# Altium schematic sheet Infrared_Send.SchDoc
size A4
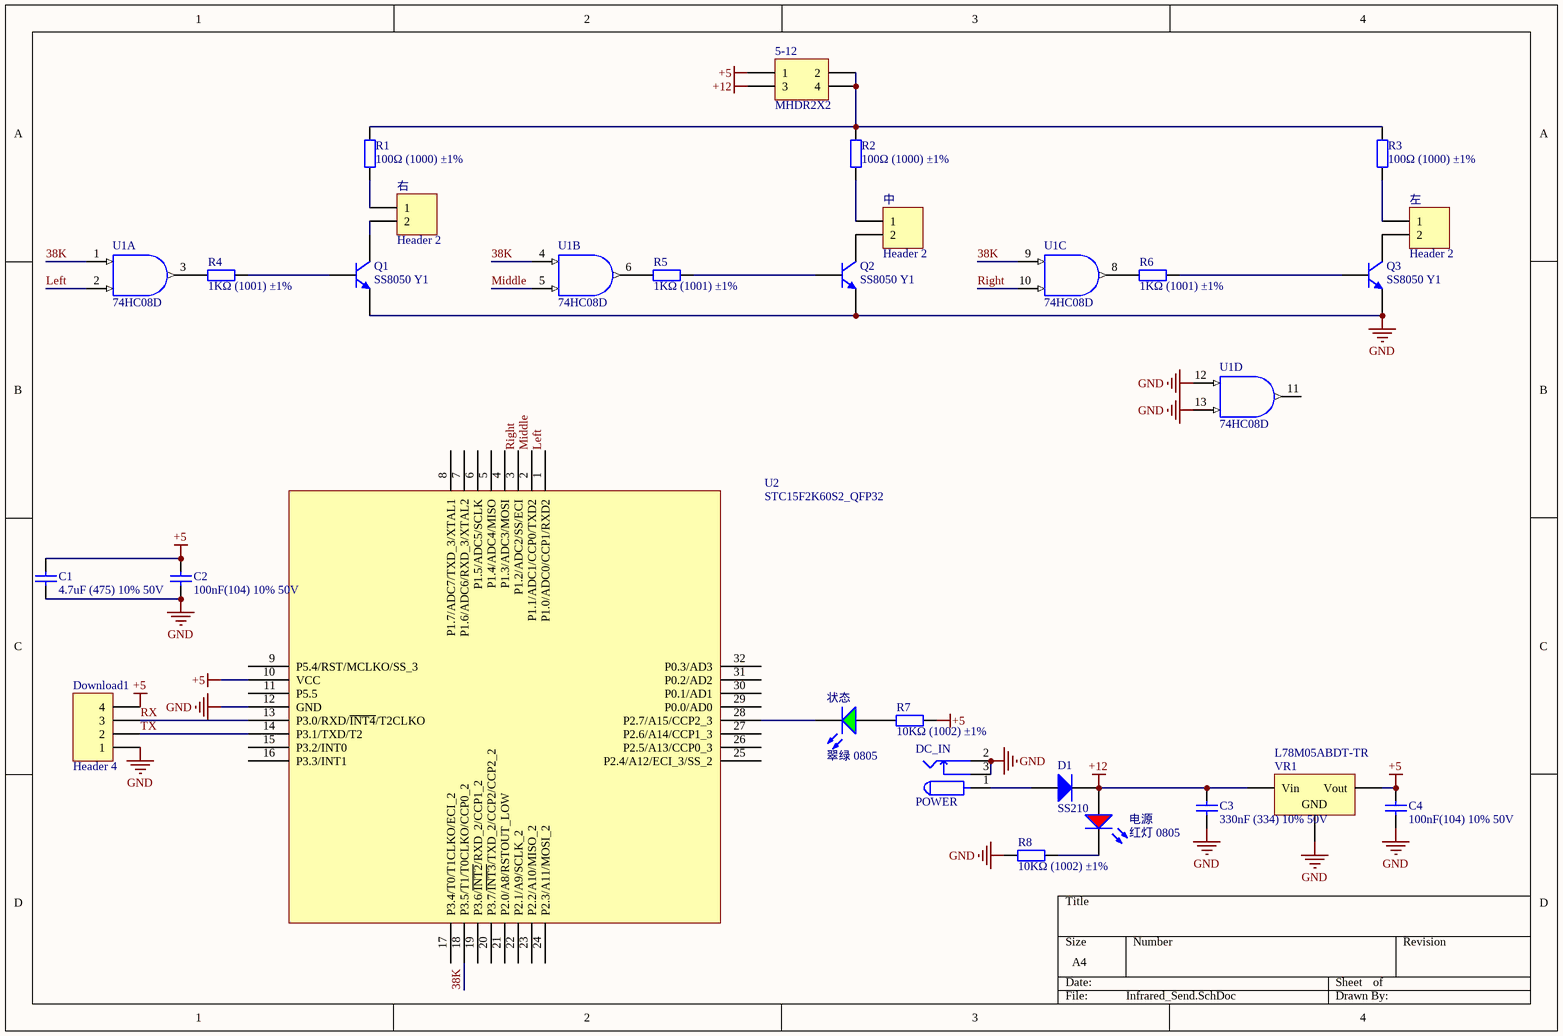
[diagram p0: Infrared_Send.SchDoc]

## Parts
5-12  MHDR2X2  [MHDR2X2]
C1  4.7uF (475) 10% 50V  [LC-1206_C]
C2  100nF(104) 10% 50V  [LC-0805_C]
C3  330nF (334) 10% 50V  [LC-0805_C]
C4  100nF(104) 10% 50V  [LC-0805_C]
D1  SS210  [LC-SMA(DO-214AC)_S1]
DC_IN  POWER  [DC10B]
Download1  Header 4  [HDR1X4]
Q1  SS8050 Y1  [LC-SOT-23(SOT-23-3)]
Q2  SS8050 Y1  [LC-SOT-23(SOT-23-3)]
Q3  SS8050 Y1  [LC-SOT-23(SOT-23-3)]
R1  100Ω (1000) ±1%  [LC-0805_R]
R2  100Ω (1000) ±1%  [LC-0805_R]
R3  100Ω (1000) ±1%  [LC-0805_R]
R4  1KΩ (1001) ±1%  [LC-0805_R]
R5  1KΩ (1001) ±1%  [LC-0805_R]
R6  1KΩ (1001) ±1%  [LC-0805_R]
R7  10KΩ (1002) ±1%  [LC-0805_R]
R8  10KΩ (1002) ±1%  [LC-0805_R]
U1  74HC08D  [LC-SOIC-14_150mil]  (parts A,B,C,D of 4)
U2  STC15F2K60S2_QFP32  [LQFP32]
VR1  L78M05ABDT-TR  [LC-TO-252-2-180]
中  Header 2  [HDR1X2]
右  Header 2  [HDR1X2]
左  Header 2  [HDR1X2]
状态  翠绿 0805  [LC-0805_LED_S1]
电源  红灯 0805  [LC-0805_LED_S1]

## Nets
+5: 5-12.1 C1.2 C2.2 C4.2 Download1.4 R7.1 U2.10(VCC) VR1.3(Vout)
+12: 5-12.3 C3.2 D1.2(K) VR1.1(Vin) 电源.A
GND: C1.1 C2.1 C3.1 C4.1 DC_IN.2 DC_IN.3 Download1.1 Q1.2(E) Q2.2(E) Q3.2(E) R8.1 U1.12(A) U1.13(B) U2.12(GND) VR1.2(GND)
38K: U1.1(A) U1.4(A) U1.9(A) U2.18(P3.5/T1/T0CLKO/CCP0_2)
Left: U1.2(B) U2.1(P1.0/ADC0/CCP1/RXD2)
Middle: U1.5(B) U2.2(P1.1/ADC1/CCP0/TXD2)
Right: U1.10(B) U2.3(P1.2/ADC2/SS/ECI)
RX: Download1.3 U2.13(P3.0/RXD/~{INT4}/T2CLKO)
TX: Download1.2 U2.14(P3.1/TXD/T2)
Net5-12_2: 5-12.2 5-12.4 R1.2 R2.2 R3.2
NetD1_1: D1.1(A) DC_IN.1
NetQ1_1: Q1.1(B) R4.2
NetQ1_3: Q1.3(C) 右.2
NetQ2_1: Q2.1(B) R5.2
NetQ2_3: Q2.3(C) 中.2
NetQ3_1: Q3.1(B) R6.2
NetQ3_3: Q3.3(C) 左.2
NetR1_1: R1.1 右.1
NetR2_1: R2.1 中.1
NetR3_1: R3.1 左.1
NetR4_1: R4.1 U1.3(Y)
NetR5_1: R5.1 U1.6(Y)
NetR6_1: R6.1 U1.8(Y)
NetR7_2: R7.2 状态.A
NetR8_2: R8.2 电源.K
NetU2_28: U2.28(P2.7/A15/CCP2_3) 状态.K

Not connected (* = marked no-connect by the designer): U1 7(GND) 11(Y) 14(VDD); U2 4(P1.3/ADC3/MOSI) 5(P1.4/ADC4/MISO) 6(P1.5/ADC5/SCLK) 7(P1.6/ADC6/RXD_3/XTAL2) 8(P1.7/ADC7/TXD_3/XTAL1) 9(P5.4/RST/MCLKO/SS_3) 11(P5.5) 15(P3.2/INT0) 16(P3.3/INT1) 17(P3.4/T0/T1CLKO/ECI_2) 19(P3.6/~{INT2}/RXD_2/CCP1_2) 20(P3.7/~{INT3}/TXD_2/CCP2/CCP2_2) 21(P2.0/A8/RSTOUT_LOW) 22(P2.1/A9/SCLK_2) 23(P2.2/A10/MISO_2) 24(P2.3/A11/MOSI_2) 25(P2.4/A12/ECI_3/SS_2) 26(P2.5/A13/CCP0_3) 27(P2.6/A14/CCP1_3) 29(P0.0/AD0) 30(P0.1/AD1) 31(P0.2/AD2) 32(P0.3/AD3)

## Library data of the parts
5-12 = MHDR2X2: Header, 2-Pin, Dual row; LatestRevisionDate: 17-Jul-2002; LatestRevisionNote: Re-released for DXP Platform.; Publisher: Altium Limited
C1 = 1206 4.7uF (475) 10% 50V: 贴片电容; ComponentLink1Description: 供应商链接; ComponentLink1URL: http://www.szlcsc.com/product/details_30577.html; Package: 1206; Supplier: LC; SuppliersPartNumber: C29823
C2 C4 = 0805 100nF(104) 10% 50V: 贴片电容; ComponentLink1Description: 供应商链接; ComponentLink1URL: http://www.szlcsc.com/product/details_50686.html; Package: 0805; Supplier: LC; SuppliersPartNumber: C49678
C3 = 0805 330nF (334) 10% 50V: 贴片电容; ComponentLink1Description: 供应商链接; ComponentLink1URL: http://www.szlcsc.com/product/details_2092.html; Package: 0805; Supplier: LC; SuppliersPartNumber: C1740
D1 = SMA(DO-214AC) SS210: 二极管; ComponentLink1Description: 供应商链接; ComponentLink1URL: http://www.szlcsc.com/product/details_15669.html; Package: SMA(DO-214AC); Supplier: LC; SuppliersPartNumber: C14996
DC_IN = POW
Download1 = Header 4: Header, 4-Pin; LatestRevisionDate: 17-Jul-2002; LatestRevisionNote: Re-released for DXP Platform.; Publisher: Altium Limited
Q1-Q3 = SOT-23 SS8050 Y1: 三极管; ComponentLink1Description: 供应商链接; ComponentLink1URL: http://www.szlcsc.com/product/details_2507.html; Package: SOT-23; Supplier: LC; SuppliersPartNumber: C2150
R1-R3 = 0805 100Ω (1000) 1%: 贴片电阻; ComponentLink1Description: 供应商链接; ComponentLink1URL: http://www.szlcsc.com/product/details_18096.html; Package: 0805; Supplier: LC; SuppliersPartNumber: C17408
R4-R6 = 0805 1KΩ (1001) 1%: 贴片电阻; ComponentLink1Description: 供应商链接; ComponentLink1URL: http://www.szlcsc.com/product/details_18201.html; Package: 0805; Supplier: LC; SuppliersPartNumber: C17513
R7 R8 = 0805 10KΩ (1002) 1%: 贴片电阻; ComponentLink1Description: 供应商链接; ComponentLink1URL: http://www.szlcsc.com/product/details_18102.html; Package: 0805; Supplier: LC; SuppliersPartNumber: C17414
U1 = 74HC08D: 74系列逻辑芯片; ComponentLink1Description: 供应商链接; ComponentLink1URL: http://www.szlcsc.com/product/details_6044.html; Package: SOIC-14_150mil; Supplier: LC; SuppliersPartNumber: C5593
VR1 = TO-252-2 L78M05ABDT-TR: 低压差线性稳压(LDO); ComponentLink1Description: 供应商链接; ComponentLink1URL: http://www.szlcsc.com/product/details_59107.html; Package: TO-252-2; Supplier: LC; SuppliersPartNumber: C58069
中 右 左 = Header 2: Header, 2-Pin; LatestRevisionDate: 17-Jul-2002; LatestRevisionNote: Re-released for DXP Platform.; Publisher: Altium Limited
状态 = 0805 翠绿: 发光二极管; ComponentLink1Description: 供应商链接; ComponentLink1URL: http://www.szlcsc.com/product/details_2670.html; Package: 0805; Supplier: LC; SuppliersPartNumber: C2297
电源 = 0805 红灯: 发光二极管; ComponentLink1Description: 供应商链接; ComponentLink1URL: http://www.szlcsc.com/product/details_2668.html; Package: 0805; Supplier: LC; SuppliersPartNumber: C2295